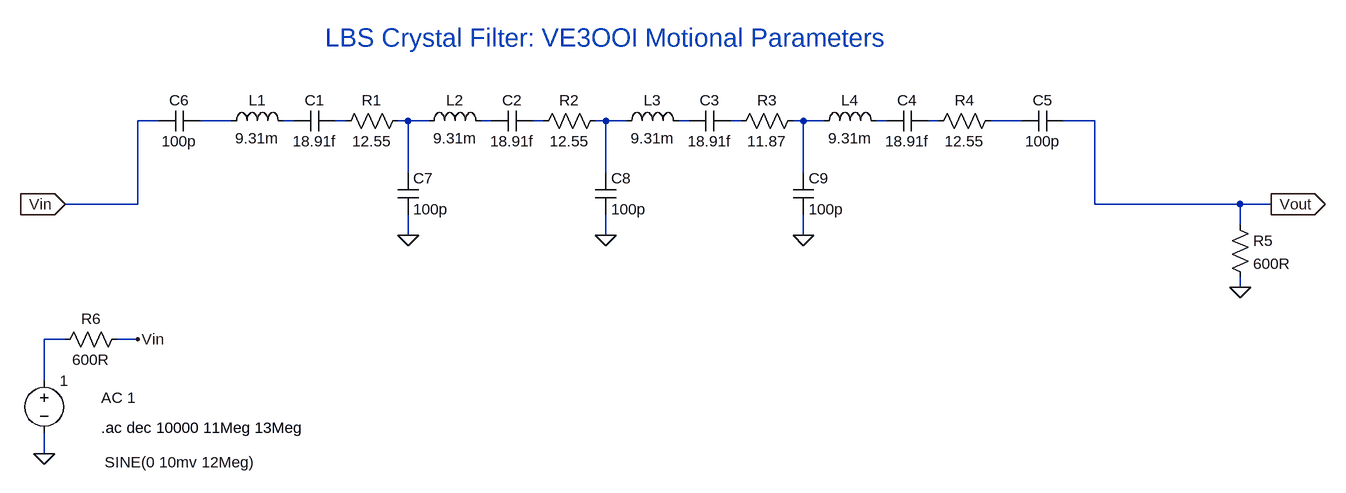
[diagram p0: schematic 12 Mhz Crystal Filter Testing.asc]
12 Mhz Crystal Filter Testing.asc, the LTspice schematic file:
Version 4
SHEET 1 1736 680
WIRE -96 -416 -128 -416
WIRE 16 -416 -32 -416
WIRE 112 -416 96 -416
WIRE 192 -416 176 -416
WIRE 288 -416 272 -416
WIRE 320 -416 288 -416
WIRE 416 -416 400 -416
WIRE 496 -416 480 -416
WIRE 592 -416 576 -416
WIRE 624 -416 592 -416
WIRE 720 -416 704 -416
WIRE 800 -416 784 -416
WIRE 896 -416 880 -416
WIRE 928 -416 896 -416
WIRE 1024 -416 1008 -416
WIRE 1104 -416 1088 -416
WIRE 1232 -416 1184 -416
WIRE 1344 -416 1296 -416
WIRE 288 -336 288 -416
WIRE 592 -336 592 -416
WIRE 896 -336 896 -416
WIRE -128 -288 -128 -416
WIRE -128 -288 -240 -288
WIRE 1344 -288 1344 -416
WIRE 1568 -288 1344 -288
WIRE 1616 -288 1568 -288
WIRE 1568 -256 1568 -288
WIRE 288 -240 288 -272
WIRE 592 -240 592 -272
WIRE 896 -240 896 -272
WIRE 1568 -160 1568 -176
WIRE -240 -80 -272 -80
WIRE -128 -80 -160 -80
WIRE -272 -16 -272 -80
WIRE -272 96 -272 64
FLAG 896 -240 0
FLAG 592 -240 0
FLAG 288 -240 0
FLAG -272 96 0
FLAG -128 -80 Vin
FLAG 1616 -288 Vout
IOPIN 1616 -288 Out
FLAG -240 -288 Vin
IOPIN -240 -288 In
FLAG 1568 -160 0
SYMBOL ind 0 -400 R270
WINDOW 0 32 56 VTop 2
WINDOW 3 5 56 VBottom 2
SYMATTR InstName L1
SYMATTR Value 9.31m
SYMBOL cap 176 -432 R90
WINDOW 0 0 32 VBottom 2
WINDOW 3 32 32 VTop 2
SYMATTR InstName C1
SYMATTR Value 18.91f
SYMBOL res 288 -432 R90
WINDOW 0 0 56 VBottom 2
WINDOW 3 32 56 VTop 2
SYMATTR InstName R1
SYMATTR Value 12.55
SYMBOL ind 304 -400 R270
WINDOW 0 32 56 VTop 2
WINDOW 3 5 56 VBottom 2
SYMATTR InstName L2
SYMATTR Value 9.31m
SYMBOL cap 480 -432 R90
WINDOW 0 0 32 VBottom 2
WINDOW 3 32 32 VTop 2
SYMATTR InstName C2
SYMATTR Value 18.91f
SYMBOL res 592 -432 R90
WINDOW 0 0 56 VBottom 2
WINDOW 3 32 56 VTop 2
SYMATTR InstName R2
SYMATTR Value 12.55
SYMBOL ind 608 -400 R270
WINDOW 0 32 56 VTop 2
WINDOW 3 5 56 VBottom 2
SYMATTR InstName L3
SYMATTR Value 9.31m
SYMBOL cap 784 -432 R90
WINDOW 0 0 32 VBottom 2
WINDOW 3 32 32 VTop 2
SYMATTR InstName C3
SYMATTR Value 18.91f
SYMBOL res 896 -432 R90
WINDOW 0 0 56 VBottom 2
WINDOW 3 32 56 VTop 2
SYMATTR InstName R3
SYMATTR Value 11.87
SYMBOL ind 912 -400 R270
WINDOW 0 32 56 VTop 2
WINDOW 3 5 56 VBottom 2
SYMATTR InstName L4
SYMATTR Value 9.31m
SYMBOL cap 1088 -432 R90
WINDOW 0 0 32 VBottom 2
WINDOW 3 32 32 VTop 2
SYMATTR InstName C4
SYMATTR Value 18.91f
SYMBOL res 1200 -432 R90
WINDOW 0 0 56 VBottom 2
WINDOW 3 32 56 VTop 2
SYMATTR InstName R4
SYMATTR Value 12.55
SYMBOL cap 1232 -400 R270
WINDOW 0 32 32 VTop 2
WINDOW 3 0 32 VBottom 2
SYMATTR InstName C5
SYMATTR Value 100p
SYMBOL cap -96 -400 R270
WINDOW 0 32 32 VTop 2
WINDOW 3 0 32 VBottom 2
SYMATTR InstName C6
SYMATTR Value 100p
SYMBOL cap 272 -336 R0
SYMATTR InstName C7
SYMATTR Value 100p
SYMBOL cap 576 -336 R0
SYMATTR InstName C8
SYMATTR Value 100p
SYMBOL cap 880 -336 R0
SYMATTR InstName C9
SYMATTR Value 100p
SYMBOL voltage -272 -32 R0
WINDOW 123 88 42 Left 2
WINDOW 39 89 0 Left 2
WINDOW 3 93 141 Left 2
SYMATTR Value2 AC 1
SYMATTR Value SINE(0 10mv 12Meg)
SYMATTR InstName 1
SYMBOL res 1552 -272 R0
SYMATTR InstName R5
SYMATTR Value 600R
SYMBOL res -144 -96 R90
WINDOW 0 0 56 VBottom 2
WINDOW 3 32 56 VTop 2
SYMATTR InstName R6
SYMATTR Value 600R
TEXT -184 56 Left 2 !.ac dec 10000 11Meg 13Meg
TEXT 160 -544 Left 4 ;LBS Crystal Filter: VE3OOI Motional Parameters

The netlist it stands for:
* 12 Mhz Crystal Filter Testing.asc
L1 N001 N002 9.31m
C1 N003 N002 18.91f
R1 N004 N003 12.55
L2 N004 N005 9.31m
C2 N006 N005 18.91f
R2 N007 N006 12.55
L3 N007 N008 9.31m
C3 N009 N008 18.91f
R3 N010 N009 11.87
L4 N010 N011 9.31m
C4 N012 N011 18.91f
R4 N013 N012 12.55
C5 N013 Vout 100p
C6 Vin N001 100p
C7 N004 0 100p
C8 N007 0 100p
C9 N010 0 100p
V§1 N014 0 SINE(0 10mv 12Meg) AC 1
R5 Vout 0 600R
R6 Vin N014 600R
.ac dec 10000 11Meg 13Meg
* LBS Crystal Filter: VE3OOI Motional Parameters
.backanno
.end